# Altium schematic sheet ProcessorPower.SchDoc
size A4; SheetNumber: 3; SheetTotal: 3
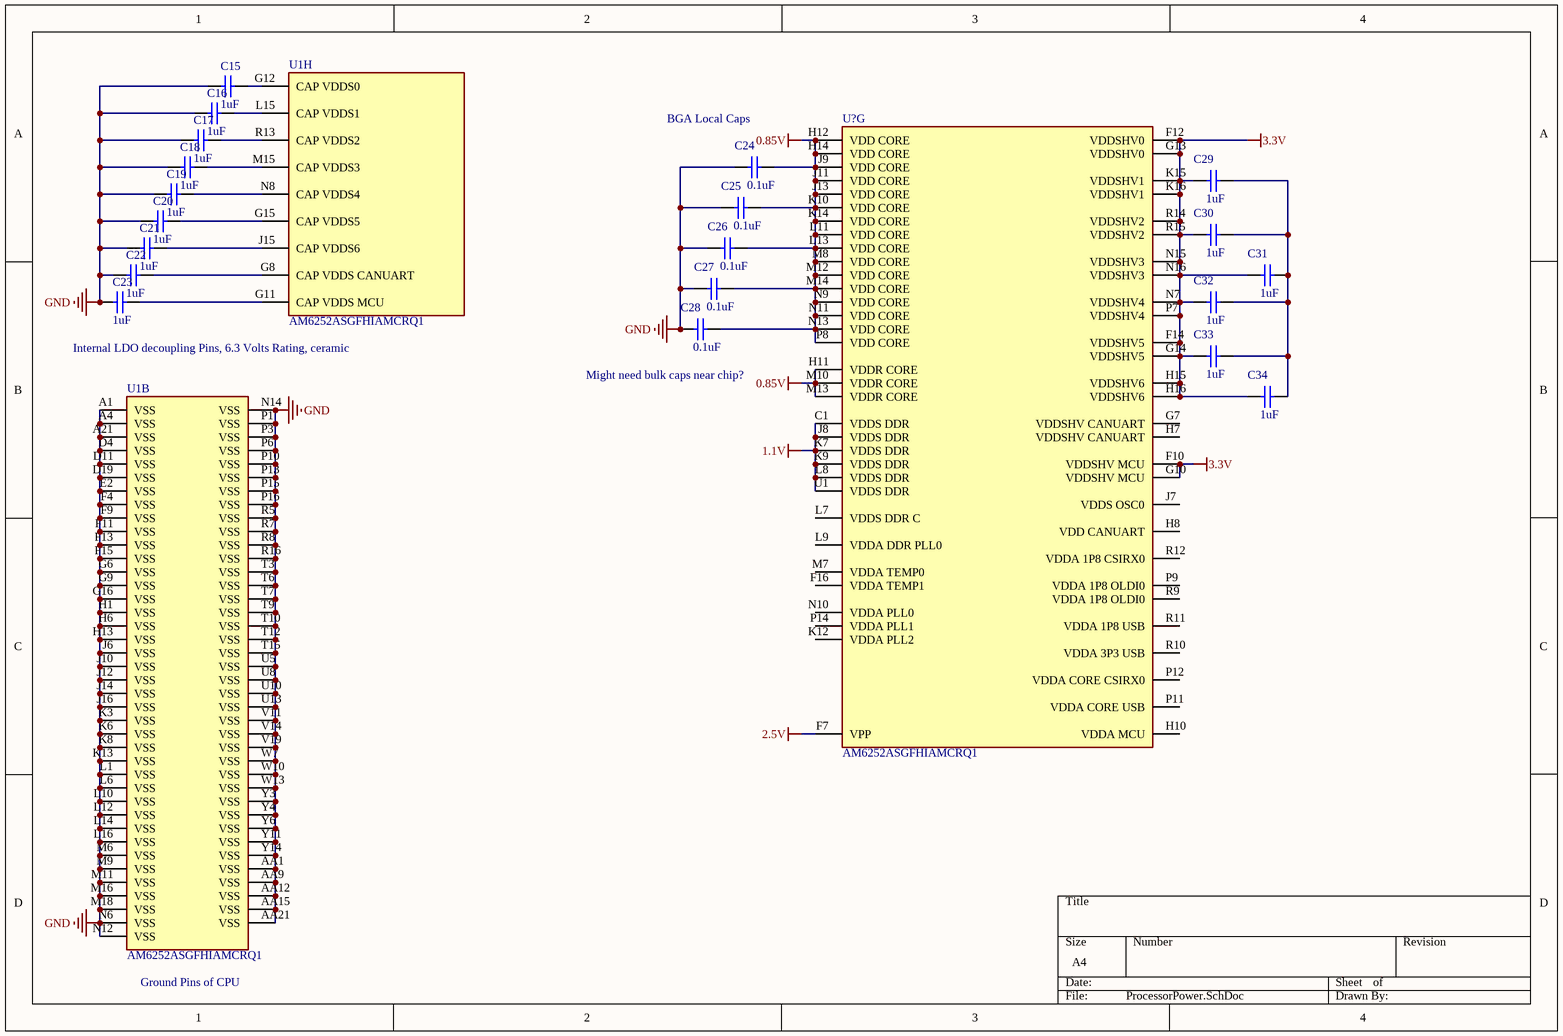
[diagram p0: ProcessorPower.SchDoc]

## Parts
C15  value 1uF  (hidden comment: Capacitor)
C16  value 1uF  (hidden comment: Capacitor)
C17  value 1uF  (hidden comment: Capacitor)
C18  value 1uF  (hidden comment: Capacitor)
C19  value 1uF  (hidden comment: Capacitor)
C20  value 1uF  (hidden comment: Capacitor)
C21  value 1uF  (hidden comment: Capacitor)
C22  value 1uF  (hidden comment: Capacitor)
C23  value 1uF  (hidden comment: Capacitor)
C24  value 0.1uF  (hidden comment: Capacitor)
C25  value 0.1uF  (hidden comment: Capacitor)
C26  value 0.1uF  (hidden comment: Capacitor)
C27  value 0.1uF  (hidden comment: Capacitor)
C28  value 0.1uF  (hidden comment: Capacitor)
C29  value 1uF  (hidden comment: Capacitor)
C30  value 1uF  (hidden comment: Capacitor)
C31  value 1uF  (hidden comment: Capacitor)
C32  value 1uF  (hidden comment: Capacitor)
C33  value 1uF  (hidden comment: Capacitor)
C34  value 1uF  (hidden comment: Capacitor)
U1  AM6252ASGFHIAMCRQ1  [FP-AMC0441A-MFG]  (parts B,H of 13)
U?  AM6252ASGFHIAMCRQ1  [FP-AMC0441A-MFG]  (part G of 13)

## Nets
0.85V: C24.2 C25.2 C26.2 C27.2 C28.2 U?.H11(VDDR_CORE) U?.H12(VDD_CORE) U?.H14(VDD_CORE) U?.J9(VDD_CORE) U?.J11(VDD_CORE) U?.J13(VDD_CORE) U?.K10(VDD_CORE) U?.K14(VDD_CORE) U?.L11(VDD_CORE) U?.L13(VDD_CORE) U?.M8(VDD_CORE) U?.M10(VDDR_CORE) U?.M12(VDD_CORE) U?.M13(VDDR_CORE) U?.M14(VDD_CORE) U?.N9(VDD_CORE) U?.N11(VDD_CORE) U?.N13(VDD_CORE) U?.P8(VDD_CORE)
1.1V: U?.C1(VDDS_DDR) U?.J8(VDDS_DDR) U?.K7(VDDS_DDR) U?.K9(VDDS_DDR) U?.L8(VDDS_DDR) U?.U1(VDDS_DDR)
2.5V: U?.F7(VPP)
3.3V: C29.1 C30.1 C31.1 C32.1 C33.1 C34.1 U?.F10(VDDSHV_MCU) U?.F12(VDDSHV0) U?.F14(VDDSHV5) U?.G10(VDDSHV_MCU) U?.G13(VDDSHV0) U?.G14(VDDSHV5) U?.H15(VDDSHV6) U?.H16(VDDSHV6) U?.K15(VDDSHV1) U?.K16(VDDSHV1) U?.N7(VDDSHV4) U?.N15(VDDSHV3) U?.N16(VDDSHV3) U?.P7(VDDSHV4) U?.R14(VDDSHV2) U?.R15(VDDSHV2)
GND: C15.1 C16.1 C17.1 C18.1 C19.1 C20.1 C21.1 C22.1 C23.1 C24.1 C25.1 C26.1 C27.1 C28.1 U1.A1(VSS) U1.A4(VSS) U1.A21(VSS) U1.AA1(VSS) U1.AA9(VSS) U1.AA12(VSS) U1.AA15(VSS) U1.AA21(VSS) U1.D4(VSS) U1.D11(VSS) U1.D19(VSS) U1.E2(VSS) U1.F4(VSS) U1.F9(VSS) U1.F11(VSS) U1.F13(VSS) U1.F15(VSS) U1.G6(VSS) U1.G9(VSS) U1.G16(VSS) U1.H1(VSS) U1.H6(VSS) U1.H13(VSS) U1.J6(VSS) U1.J10(VSS) U1.J12(VSS) U1.J14(VSS) U1.J16(VSS) U1.K3(VSS) U1.K6(VSS) U1.K8(VSS) U1.K13(VSS) U1.L1(VSS) U1.L6(VSS) U1.L10(VSS) U1.L12(VSS) U1.L14(VSS) U1.L16(VSS) U1.M6(VSS) U1.M9(VSS) U1.M11(VSS) U1.M16(VSS) U1.M18(VSS) U1.N6(VSS) U1.N12(VSS) U1.N14(VSS) U1.P1(VSS) U1.P3(VSS) U1.P6(VSS) U1.P10(VSS) U1.P13(VSS) U1.P15(VSS) U1.P16(VSS) U1.R5(VSS) U1.R7(VSS) U1.R8(VSS) U1.R16(VSS) U1.T3(VSS) U1.T6(VSS) U1.T7(VSS) U1.T9(VSS) U1.T10(VSS) U1.T12(VSS) U1.T15(VSS) U1.U5(VSS) U1.U8(VSS) U1.U10(VSS) U1.U13(VSS) U1.V11(VSS) U1.V14(VSS) U1.V19(VSS) U1.W7(VSS) U1.W10(VSS) U1.W13(VSS) U1.Y3(VSS) U1.Y4(VSS) U1.Y6(VSS) U1.Y11(VSS) U1.Y14(VSS)
NetC15_2: C15.2 U1.G12(CAP_VDDS0)
NetC16_2: C16.2 U1.L15(CAP_VDDS1)
NetC17_2: C17.2 U1.R13(CAP_VDDS2)
NetC18_2: C18.2 U1.M15(CAP_VDDS3)
NetC19_2: C19.2 U1.N8(CAP_VDDS4)
NetC20_2: C20.2 U1.G15(CAP_VDDS5)
NetC21_2: C21.2 U1.J15(CAP_VDDS6)
NetC22_2: C22.2 U1.G8(CAP_VDDS_CANUART)
NetC23_2: C23.2 U1.G11(CAP_VDDS_MCU)
NetC29_2: C29.2 C30.2 C31.2 C32.2 C33.2 C34.2

Not connected (* = marked no-connect by the designer): U? F16(VDDA_TEMP1) G7(VDDSHV_CANUART) H7(VDDSHV_CANUART) H8(VDD_CANUART) H10(VDDA_MCU) J7(VDDS_OSC0) K12(VDDA_PLL2) L7(VDDS_DDR_C) L9(VDDA_DDR_PLL0) M7(VDDA_TEMP0) N10(VDDA_PLL0) P9(VDDA_1P8_OLDI0) P11(VDDA_CORE_USB) P12(VDDA_CORE_CSIRX0) P14(VDDA_PLL1) R9(VDDA_1P8_OLDI0) R10(VDDA_3P3_USB) R11(VDDA_1P8_USB) R12(VDDA_1P8_CSIRX0)

## Notes on the sheet
- (near C24) BGA Local Caps
- Internal LDO decoupling Pins, 6.3 Volts Rating, ceramic
- (near C28) Might need bulk caps near chip?
- (near U1) Ground Pins of CPU

## Library data of the parts
C15-C34 = Capacitor: SimulationGenericComponent: True
U1 U? = CMP-00370-141208177-1: AM6252ASGFHIAMCRQ1 Automotive display SoC with embedded safety for digital clusters 441-FCBGA -40 to 125; Manufacturer Lifecycle Status: ACTIVE; Thickness: 2.03mm; Width: 17.2mm; Number of Pins: 441; Lifecycle Status: Production; Height: 0m; Case/Package: FCBGA; Length: 17.2mm; NexarPartId: 141208177